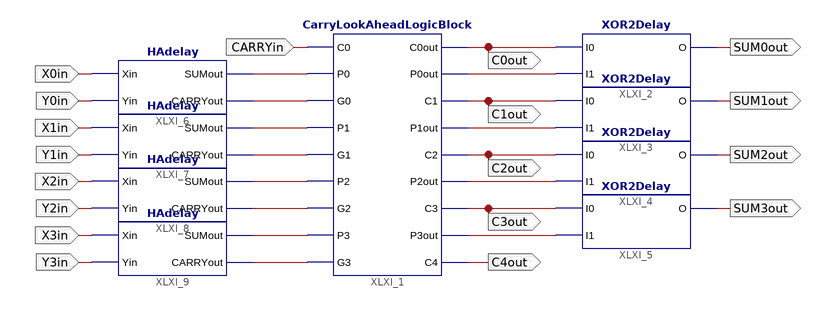
[diagram p0: schematic sheet 1]
// Xilinx ISE schematic FourBitCLA.sch (spartan6) as structural Verilog: 9 symbols, 18 ports
module FourBitCLA (
  input  CARRYin,
  input  X0in,
  input  Y0in,
  input  X1in,
  input  Y1in,
  input  X2in,
  input  Y2in,
  input  X3in,
  input  Y3in,
  output C0out,
  output C1out,
  output C2out,
  output C3out,
  output SUM0out,
  output SUM1out,
  output SUM2out,
  output SUM3out,
  output C4out
);

  wire XLXN_2, XLXN_4, XLXN_6, XLXN_8, XLXN_9, XLXN_10, XLXN_11, XLXN_12, XLXN_13, XLXN_14, XLXN_15, XLXN_16;

  CarryLookAheadLogicBlock XLXI_1 (
    .C0(CARRYin), .P0(XLXN_9), .G0(XLXN_10), .P1(XLXN_11), .G1(XLXN_12), .P2(XLXN_13), .G2(XLXN_14),
    .P3(XLXN_15), .G3(XLXN_16), .C0out(C0out), .P0out(XLXN_2), .C1(C1out), .P1out(XLXN_4), .C2(C2out),
    .P2out(XLXN_6), .C3(C3out), .P3out(XLXN_8), .C4(C4out));
  XOR2Delay XLXI_4 (.I0(C2out), .I1(XLXN_6), .O(SUM2out));
  XOR2Delay XLXI_5 (.I0(C3out), .I1(XLXN_8), .O(SUM3out));
  XOR2Delay XLXI_2 (.I0(C0out), .I1(XLXN_2), .O(SUM0out));
  XOR2Delay XLXI_3 (.I0(C1out), .I1(XLXN_4), .O(SUM1out));
  HAdelay XLXI_6 (.Xin(X0in), .Yin(Y0in), .SUMout(XLXN_9), .CARRYout(XLXN_10));
  HAdelay XLXI_7 (.Xin(X1in), .Yin(Y1in), .SUMout(XLXN_11), .CARRYout(XLXN_12));
  HAdelay XLXI_8 (.Xin(X2in), .Yin(Y2in), .SUMout(XLXN_13), .CARRYout(XLXN_14));
  HAdelay XLXI_9 (.Xin(X3in), .Yin(Y3in), .SUMout(XLXN_15), .CARRYout(XLXN_16));
endmodule
